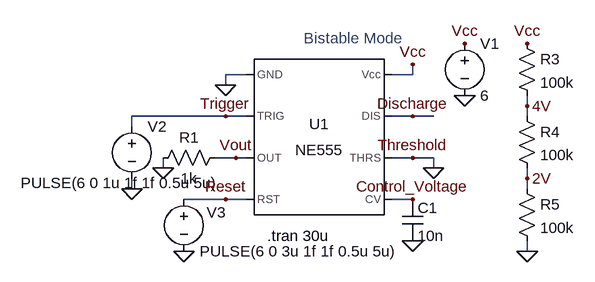
[diagram p0: schematic Bistable.asc]
Bistable.asc, the LTspice schematic file:
Version 4
SHEET 1 880 680
WIRE 64 80 32 80
WIRE 320 80 320 64
WIRE 320 80 288 80
WIRE 32 96 32 80
WIRE 496 128 496 112
WIRE 32 144 -112 144
WIRE 64 144 32 144
WIRE 320 144 288 144
WIRE 352 144 320 144
WIRE 496 144 496 128
WIRE -112 160 -112 144
WIRE 48 208 16 208
WIRE 64 208 48 208
WIRE 320 208 288 208
WIRE 352 208 320 208
WIRE -64 224 -64 208
WIRE 352 224 352 208
WIRE 496 240 496 224
WIRE -112 256 -112 240
WIRE 496 256 496 240
WIRE 32 272 -32 272
WIRE 64 272 32 272
WIRE 320 272 288 272
WIRE 496 352 496 336
FLAG 400 112 0
FLAG 400 32 Vcc
FLAG 320 64 Vcc
FLAG 32 96 0
FLAG -64 224 0
FLAG 320 336 0
FLAG -112 256 0
FLAG 32 144 Trigger
FLAG 48 208 Vout
FLAG 32 272 Reset
FLAG 320 272 Control_Voltage
FLAG 320 208 Threshold
FLAG 320 144 Discharge
FLAG 496 352 0
FLAG 496 32 Vcc
FLAG 496 240 2V
FLAG 496 128 4V
FLAG 352 224 0
FLAG -32 352 0
SYMBOL Misc\\NE555 176 176 R0
SYMATTR InstName U1
SYMBOL voltage 400 16 R0
WINDOW 123 0 0 Left 2
WINDOW 39 0 0 Left 2
SYMATTR InstName V1
SYMATTR Value 6
SYMBOL res 32 192 R90
WINDOW 0 0 56 VBottom 2
WINDOW 3 32 56 VTop 2
SYMATTR InstName R1
SYMATTR Value 1k
SYMBOL cap 304 272 R0
WINDOW 0 24 13 Left 2
SYMATTR InstName C1
SYMATTR Value 10n
SYMBOL voltage -112 144 R0
WINDOW 3 -171 103 Left 2
WINDOW 123 0 0 Left 2
WINDOW 39 0 0 Left 2
SYMATTR Value PULSE(6 0 1u 1f 1f 0.5u 5u)
SYMATTR InstName V2
SYMBOL res 480 16 R0
SYMATTR InstName R3
SYMATTR Value 100k
SYMBOL res 480 128 R0
SYMATTR InstName R4
SYMATTR Value 100k
SYMBOL res 480 240 R0
SYMATTR InstName R5
SYMATTR Value 100k
SYMBOL voltage -32 256 R0
WINDOW 0 35 36 Left 2
WINDOW 123 0 0 Left 2
WINDOW 39 0 0 Left 2
SYMATTR InstName V3
SYMATTR Value PULSE(6 0 3u 1f 1f 0.5u 5u)
TEXT 96 328 Left 2 !.tran 30u
TEXT 152 24 Left 2 ;Bistable Mode

The netlist it stands for:
* Bistable.asc
XU1 0 Trigger Vout Reset Control_Voltage 0 Discharge Vcc NE555  ; pins GND TRIG OUT RST CV THRS DIS Vcc
V1 Vcc 0 6
R1 Vout 0 1k
C1 Control_Voltage 0 10n
V2 Trigger 0 PULSE(6 0 1u 1f 1f 0.5u 5u)
R3 Vcc 4V 100k
R4 4V 2V 100k
R5 2V 0 100k
V3 Reset 0 PULSE(6 0 3u 1f 1f 0.5u 5u)
.tran 30u
* Bistable Mode
.lib NE555.sub
.backanno
.end